# Altium schematic sheet power.SchDoc: Scalony Skaner Bioimpedancji
size A4; DrawnBy: Łukasz Przeniosło; Organization: Zachodniopomorski; Address1: Uniwersytet Technologiczny; Address2: w Szczecinie; Address3: Wydział Elektryczny; Address4: Katedra KISSE; Revision: 1.0; SheetNumber: 2; SheetTotal: 7
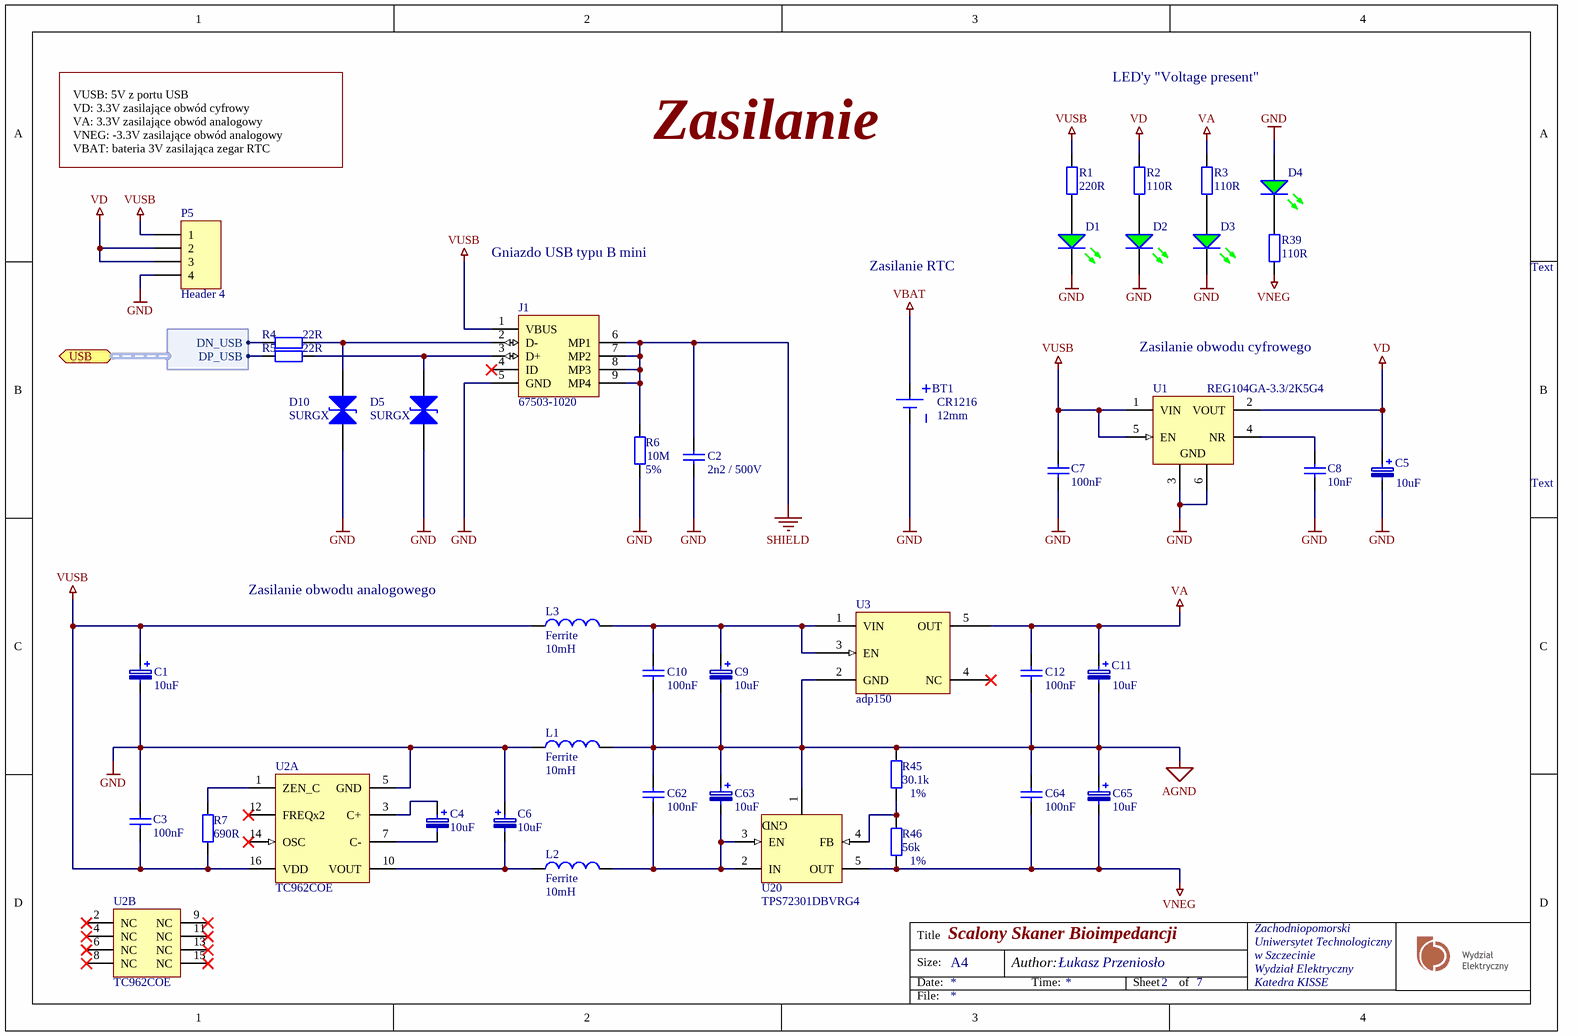
[diagram p0: power.SchDoc]

## Parts
BT1  CR1216  SIZE: 12mm  [12MM-BATTERY-HOLDER]
C1  10uF  [SMDA]
C2  2n2 / 500V  [CAPC3216N]
C3  100nF  [CAPC1608N]
C4  10uF  [SMDA]
C5  10uF  [SMDA]
C6  10uF  [SMDA]
C7  100nF  [CAPC1608N]
C8  10nF  [CAPC1608N]
C9  10uF  [SMDA]
C10  100nF  [CAPC1608N]
C11  10uF  [SMDA]
C12  100nF  [CAPC1608N]
C62  100nF  [CAPC1608N]
C63  10uF  [SMDA]
C64  100nF  [CAPC1608N]
C65  10uF  [SMDA]
D1  LL-S172GC-2A  [CD2012-0805]  (value not drawn)
D2  LL-S172GC-2A  [CD2012-0805]  (value not drawn)
D3  LL-S172GC-2A  [CD2012-0805]  (value not drawn)
D4  LL-S172GC-2A  [CD2012-0805]  (value not drawn)
D5  SURGX  [SURGX-0603]
D10  SURGX  [SURGX-0603]
J1  67503-1020  [MOLX-67503-1020_V]
L1  Ferrite  value 10mH  [FERRITE_1206]
L2  Ferrite  value 10mH  [FERRITE_1206]
L3  Ferrite  value 10mH  [FERRITE_1206]
P5  Header 4  [HDR1X4]
R1  220R  [RESC1608N]
R2  110R  [RESC1608N]
R3  110R  [RESC1608N]
R4  22R  [RESC1608N]
R5  22R  [RESC1608N]
R6  Tolerance: 5%  [RESC3216N]  (hidden comment: 10M)
R7  690R  [RESC1608N]
R39  110R  [RESC1608N]
R45  Tolerance: 1%  [RESC1608N]  (hidden comment: 30.1k)
R46  Tolerance: 1%  [RESC1608N]  (hidden comment: 56k)
U1  REG104GA-3.3/2K5G4  [TI-DCQ6_L]
U2  TC962COE  [SOIC-OE16_moje]  (parts A,B of 2)
U3  adp150  [SOT95P280X100-5N]
U20  TPS72301DBVRG4  [SOT95P280X100-5N]

## Ports
USB (harness USB)

## Harnesses
USB: DN_USB, DP_USB

## Nets
AGND: C9.2 C10.1 C11.2 C12.1 C62.2 C63.1 C64.2 C65.1 L1.2 R45.1 U3.2(GND) U20.1(GND)
GND: BT1.2(-) C1.2 C2.1 C3.1 C5.2 C6.1 C7.1 C8.1 D1.2(K) D2.2(K) D3.2(K) D4.1(A) D5.1 D10.1 J1.5(GND) L1.1 P5.4 R6.1 U1.3(GND) U1.6(GND) U2.5(GND)
SHIELD: C2.2 J1.6(MP1) J1.7(MP2) J1.8(MP3) J1.9(MP4) R6.2
VA: C11.1 C12.2 R3.2 U3.5(OUT)
VBAT: BT1.1(+)
VD: C5.1 P5.2 P5.3 R2.2 U1.2(VOUT)
VNEG: C64.1 C65.2 R39.1 R46.2 U20.5(OUT)
VUSB: C1.1 C3.2 C7.2 J1.1(VBUS) L3.1 P5.1 R1.2 R7.2 U1.1(VIN) U1.5(EN) U2.16(VDD)
NetC4_1: C4.1 U2.3(C+)
NetC4_2: C4.2 U2.7(C-)
NetC6_2: C6.2 L2.1 U2.10(VOUT)
NetC8_2: C8.2 U1.4(NR)
NetC9_1: C9.1 C10.2 L3.2 U3.1(VIN) U3.3(EN)
NetC62_1: C62.1 C63.2 L2.2 U20.2(IN) U20.3(EN)
NetD1_1: D1.1(A) R1.1
NetD2_1: D2.1(A) R2.1
NetD3_1: D3.1(A) R3.1
NetD4_2: D4.2(K) R39.2
NetD5_2: D5.2 J1.3(D+) R5.1
NetD10_2: D10.2 J1.2(D-) R4.1
NetR4_2: R4.2 ; port USB.DN_USB
NetR5_2: R5.2 ; port USB.DP_USB
NetR7_1: R7.1 U2.1(ZEN_C)
NetR45_2: R45.2 R46.1 U20.4(FB)

Not connected (* = marked no-connect by the designer): J1 4(ID)*; U2 2(NC)* 4(NC)* 6(NC)* 8(NC)* 9(NC)* 11(NC)* 12(FREQx2)* 13(NC)* 14(OSC)* 15(NC)*; U3 4(NC)*

## Notes on the sheet
- LED'y "Voltage present"
- VUSB: 5V z portu USB
  VD: 3.3V zasilające obwód cyfrowy
  VA: 3.3V zasilające obwód analogowy
  VNEG: -3.3V zasilające obwód analogowy
  VBAT: bateria 3V zasilająca zegar RTC
  GND: Masa układu
  AGND: Masa dla obwodu analogowego
- Zasilanie
- Gniazdo USB typu B mini
- Zasilanie RTC
- Text
- Zasilanie obwodu cyfrowego
- Zasilanie obwodu analogowego
- Title
- Size:
- Date:
- A4
- Author:
- Time:
- Sheet
- of
- File:

## Library data of the parts
BT1 = CMP-0438-00001-1: Lithium Battery Holder for CR2032 3V Cell; Manufacturer: TE Connectivity; PartNumber: 120591-1; Body Shape: Horizontal Cylindrical; Packing Type: Tray; ComponentLink2Description: Datasheet; ComponentLink2URL: http://www.te.com/commerce/DocumentDelivery/DDEController?Action=showdoc&DocId=Customer+Drawing%7F120591%7FH%7Fpdf%7FEnglish%7FENG_CD_120591_H.pdf%7F120591-1; DatasheetVersion: Rev. H, 01/2013; PackageReference: 120591-1; ComponentLink1Description: Manufacturer URL; Mounting Technology: Through Hole; PackageDescription: Lithium Battery Holder; ComponentLink1URL: http://www.te.com/
C1 = 10uF 10V-SMDA: Polarized Capacitor (Surface Mount); PackageReference: SMDA; Manufacturer: *; Manufacturer Part No.: *; Distributor: tme.pl; Distributor Order Code: TC 10/10-SMDA; tme.pl: TC 10/10-SMDA; Value: 10uF; farnell: 1457413
C2 C3 C7 C8 C10 C12 C62 C64 = Capacitor
  C2: Value: 2n2 / 500V
  C3 C7 C10 C12 C62 C64: Value: 100nF
  C8: Value: 10nF
C4-C6 C9 C11 C63 C65 = 100uF 6.3V-SMDB: Polarized Capacitor (Surface Mount); PackageReference: SMDB; Manufacturer: *; Manufacturer Part No.: *; Distributor: tme.pl; Distributor Order Code: TC 100/6.3-SMDB; tme.pl: TC 100/6.3-SMDB; Value: 10uF; farnell: 1135048
D1-D4 = Led Green: Typical GREEN LED; Manufacturer: Lucky Light; Value: LL-S172GC-2A
D5 D10 = SURGX: ESD Suppressor; ComponentLink1Description: Manufacturer Link; ComponentLink2Description: Datasheet; Distributor: tme.pl
J1 = CMP-0411-00002-1: USB, MINI, SMD, RA KME04-USBMU03A01; Manufacturer: Molex; ComponentLink1URL: http://www.molex.com/; PartNumber: 67503-1020; Mounting Technology: Surface Mount; ComponentLink1Description: Manufacturer URL; Terminal Pitch: 0.8 mm; DatasheetVersion: Rev F, 06/2009; ComponentLink2Description: Datasheet; PackageDescription: Mini USB Connector, SMT, Righer Angle; ComponentLink2URL: http://www.molex.com/pdm_docs/sd/675031020_sd.pdf; PackageReference: 67503-1020
L1-L3 = Inductor: Code_IEC: 1005; Published: 8-Jun-2000; LatestRevisionDate: 29-May-2009; LatestRevisionNote: IPC-7351 Footprint Added.; PackageReference: 0402-A; Publisher: Altium Limited; PackageDescription: Chip Inductor; Code_JEITA: 0402
P5 = Header 4: Header, 4-Pin; LatestRevisionDate: 17-Jul-2002; LatestRevisionNote: Re-released for DXP Platform.; Publisher: Altium Limited
R1-R5 R7 R39 = Resistor: Tolerance: 5%; Power: 0W
  R1: Value: 220R
  R2 R3 R39: Value: 110R
  R4 R5: Value: 22R
  R7: Value: 690R
R6 R45 R46 = Resistor: Power: 0W
  R6: Value: 10M
  R45: Value: 30.1k
  R46: Value: 56k
U1 = CMP-0395-00461-1: Single Output Fast Transient Response LDO, 1 A, Fixed 3.3 V Output, 2.1 to 15 V Input, 6-pin SOT-223 (DCQ), -40 to 85 degC, Green (RoHS & no Sb/Br); Manufacturer: Texas Instruments; SubFamily: Single Channel LDO; Fixed Output Options(V): 3.3; Vin(Min)(V): 2.1; Vin(Max)(V): 15; Iout(Max)(A): 1; Accuracy(%): 2; Vdo(Typ)(mV): 230; Iq(Typ)(mA): 0.6; Mounting Technology: Surface Mount; PackageVersion: 4202109/D; ComponentLink2Description: Datasheet; ComponentLink2URL: http://www.ti.com/general/docs/lit/getliterature.tsp?genericPartNumber=REG104-33&fileType=pdf; ComponentLink1URL: http://www.ti.com/; PackageDescription: 6-Pin Plastic Small Outline, Body 3.5 x 6.5 mm, Pitch 1.27 mm; PackageReference: DCQ6; ComponentLink3Description: Package Specification; DatasheetVersion: SBVS025G; Vout Adj(Min)(V): 3.3; Eco-Plan: Green (RoHS & no Sb/Br); ComponentLink3URL: http://www.ti.com/litv/pdf/mpds098c; Vout Adj(Max)(V): 3.3; ComponentLink1Description: Manufacturer URL; PartNumber: REG104GA-3.3/2K5G4
U2 = CMP-0132-00038-1: 80mA Charge Pump DC-to-DC Converter, 12kHz, 24kHz, 16-Pin SOIC 300mil, Commercial Temperature; PackageDescription: 16-Lead Plastic Small Outline (OE) - Wide 7.50mm Body [SOIC]; Code_JEDEC: MS-013-AA; Code_IPC: SOIC127P1030-16; PackageVersion: revBB, Aug-2009; PackageReference: SOIC-OE16; DatasheetVersion: revC, Jun-2006
U20 = CMP-0394-00389-1: Single Output LDO, 200 mA, Adjustable -10 to -1.2 V Output, -10 to -2.7 V Input, 5-pin SOT-23 (DBV), -40 to 125 degC, Green (RoHS & no Sb/Br); Manufacturer: Texas Instruments; Iout(Max)(A): 0.2; Iq(Typ)(mA): 0.13; Vdo(Typ)(mV): 280; SubFamily: Single Channel LDO; Accuracy(%): 2; ComponentLink1Description: Manufacturer URL; ComponentLink2Description: Datasheet; ComponentLink3URL: http://www.ti.com/litv/pdf/mpds018i; Code_JEDEC: MO-178; Vin(Min)(V): -10; ComponentLink1URL: http://www.ti.com/; PackageDescription: 5-Pin Plastic Small Outline, Body 1.60 Ã— 2.90 mm, Pitch 0.95 mm; ComponentLink3Description: Package Specification; Vout Adj(Min)(V): -10; Eco-Plan: Green (RoHS & no Sb/Br); PartNumber: TPS72301DBVRG4; Vin(Max)(V): -2.7; Mounting Technology: Surface Mount; PackageVersion: 4073253-4/K; DatasheetVersion: SLVS346B; Vout Adj(Max)(V): -1.2; ComponentLink2URL: http://www.ti.com/general/docs/lit/getliterature.tsp?genericPartNumber=TPS72301&fileType=pdf; PackageReference: DBV5